# EAGLE design irda-usb-transmitter-V3 (EAGLE 7.2.0)
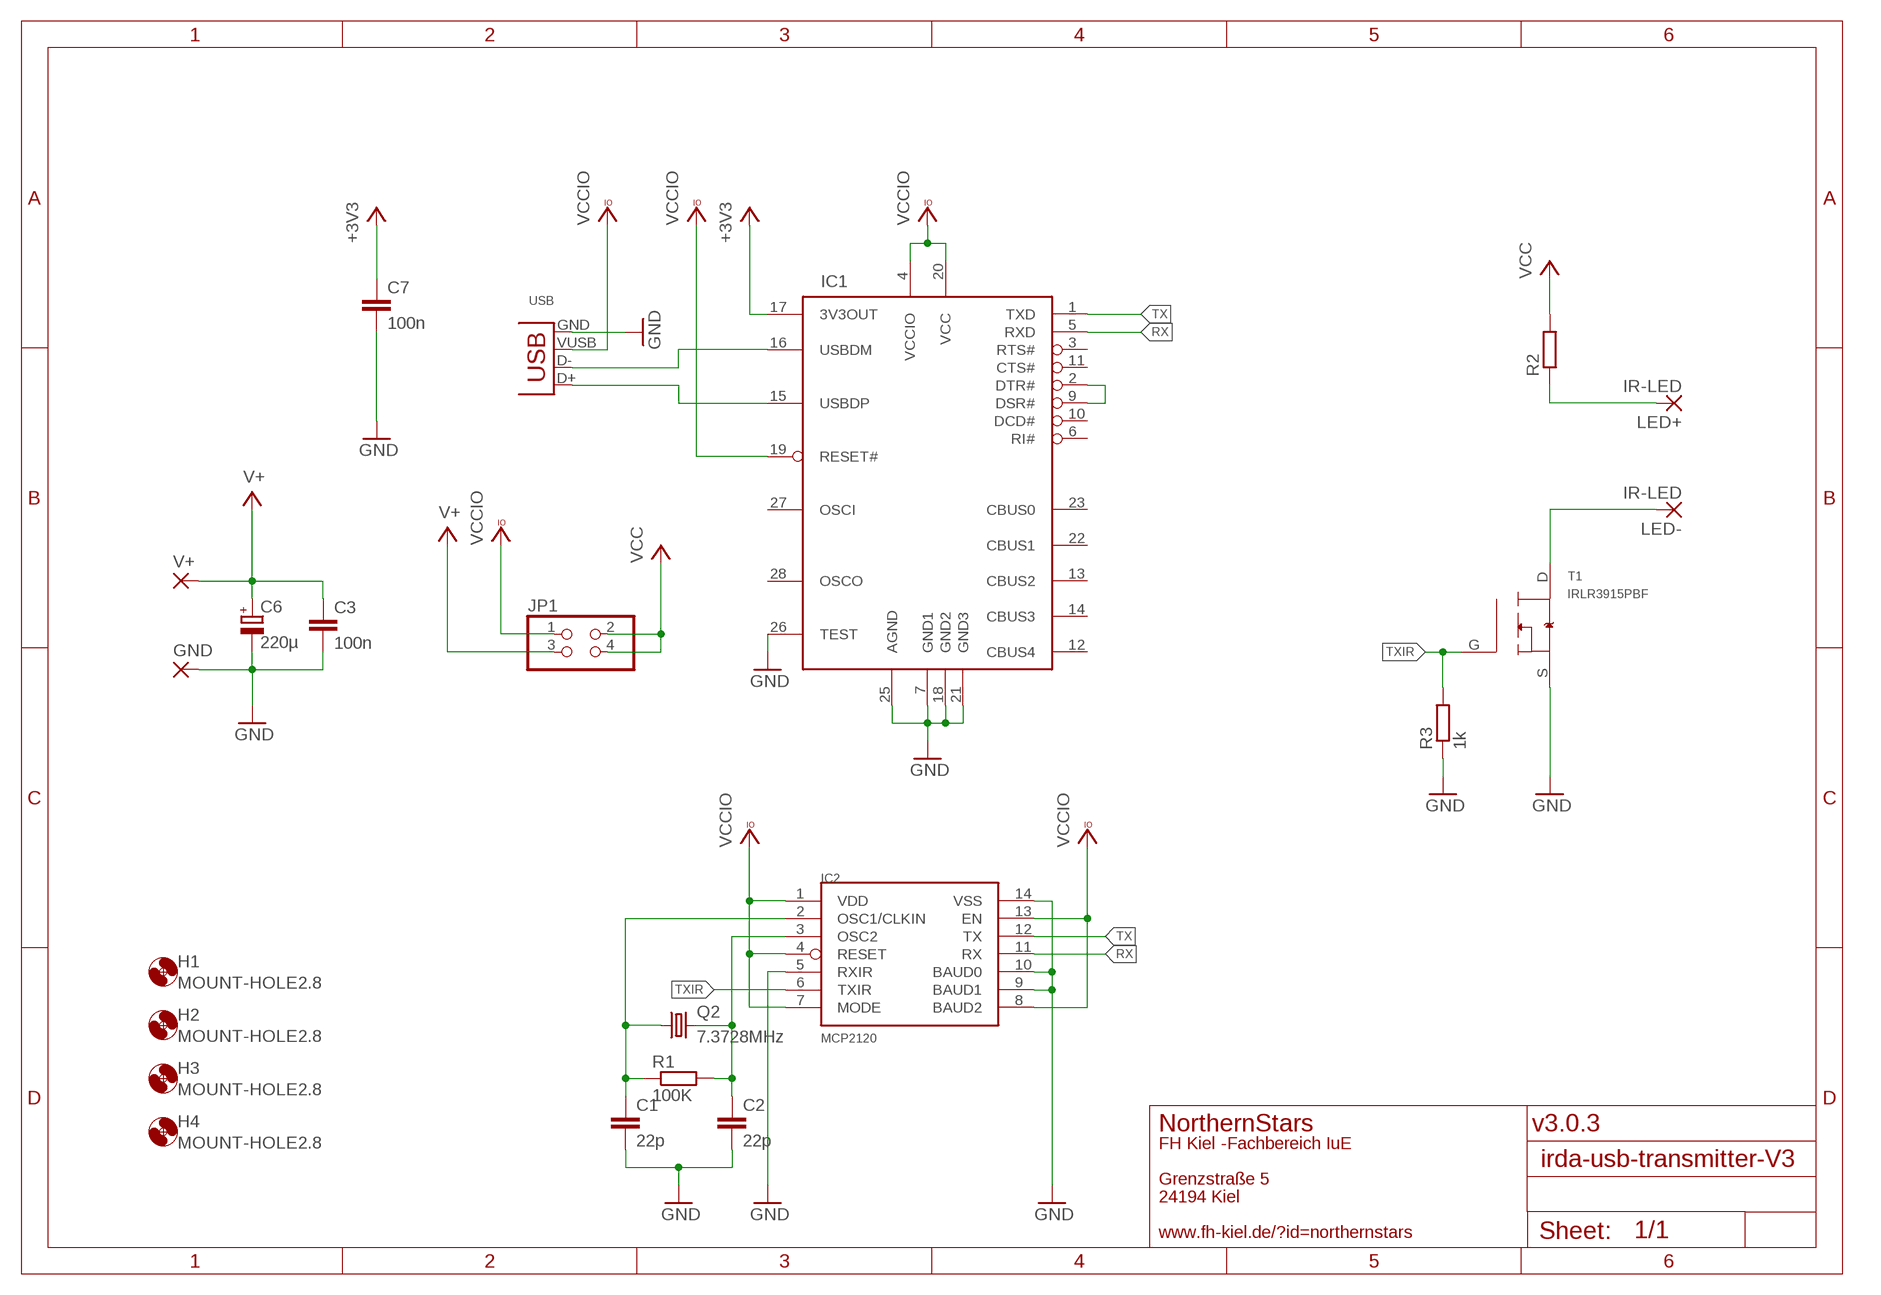
[diagram p0: schematic, sheet 1]

## Parts
C1  22p  C-EUC0805  [C0805]
C2  22p  C-EUC0805  [C0805]
C3  100n  C-EUC1206  [C1206]
C6  220µ  CPOL-EUE3.5-8  [E3,5-8]
C7  100n  C-EUC1206  [C1206]
GND  SMD5  [SMD2,54-5,08]
H1  MOUNT-HOLE2.8  [2,8]
H2  MOUNT-HOLE2.8  [2,8]
H3  MOUNT-HOLE2.8  [2,8]
H4  MOUNT-HOLE2.8  [2,8]
IC1  FT232RL  [SSOP28DB]
IC2  MCP2120  [SO-14]
JP1  PINHD-2X2  [2X02]
LED+  IR-LED  WIREPADSMD5-2,5  [5-2,5]
LED-  IR-LED  WIREPADSMD5-2,5  [5-2,5]
Q2  7.3728MHz  CRYTALHC49UP  [HC49UP]
R1  100K  R-EU_R1206  [R1206]
R2  R-EU_R1206  [R1206]
R3  1k  R-EU_R1206  [R1206]
T1  IRLR3915PBF  [D-PAK]
USB  USB-B-S  [USB-B-SMT]
V+  SMD5  [SMD2,54-5,08]

## Nets
+3V3: C7.1 IC1.17(3V3OUT)
D+: IC1.15(USBDP) USB.D+
D-: IC1.16(USBDM) USB.D-
GND: C1.2 C2.2 C3.2 C6.- C7.2 GND.1(P) IC1.7(GND1) IC1.18(GND2) IC1.21(GND3) IC1.25(AGND) IC1.26(TEST) IC2.5(RXIR) IC2.9(BAUD1) IC2.10(BAUD0) IC2.14(VSS) R3.1 T1.S USB.GND
IRLEDS-: LED-.1(P) T1.D
N$1: LED+.1(P) R2.1
N$3: IC1.2(DTR#) IC1.9(DSR#)
N$9: C1.1 IC2.2(OSC1/CLKIN) Q2.1 R1.1
N$13: C2.1 IC2.3(OSC2) Q2.2 R1.2
RX: IC1.5(RXD) IC2.11(RX)
TX: IC1.1(TXD) IC2.12(TX)
TXIR: IC2.6(TXIR) R3.2 T1.G
V+: C3.1 C6.+ JP1.3 V+.1(P)
VCC: JP1.2 JP1.4 R2.2
VCCIO: IC1.4(VCCIO) IC1.19(RESET#) IC1.20(VCC) IC2.1(VDD) IC2.4(RESET) IC2.7(MODE) IC2.8(BAUD2) IC2.13(EN) JP1.1 USB.VUSB(VBUS)
Unconnected: IC1.3(RTS#) IC1.6(RI#) IC1.10(DCD#) IC1.11(CTS#) IC1.12(CBUS4) IC1.13(CBUS2) IC1.14(CBUS3) IC1.22(CBUS1) IC1.23(CBUS0) IC1.27(OSCI) IC1.28(OSCO)

## Notes on the sheet
- NorthernStars | v3.0.3
- FH Kiel -Fachbereich IuE
- Grenzstraße 5
- 24194 Kiel
- www.fh-kiel.de/?id=northernstars

## Library data of the parts
C1-C3 C7 = rcl:C-EU: CAPACITOR, European symbol
C6 = rcl:CPOL-EU: POLARIZED CAPACITOR, European symbol
GND V+ = wirepad:SMD5: SMD PAD
H1-H4 = holes:MOUNT-HOLE: MOUNTING HOLE with drill center marker
IC1 = ftdichip-3:FT232RL: USB UART 4th Generation USB UART (USB <-> Serial) Controller
IC2 = microchip:MCP2120
JP1 = pinhead:PINHD-2X2: PIN HEADER
LED+ LED- = wirepad:WIREPAD: Wire PAD connect wire on PCB
Q2 = crystal:CRYTAL: CRYSTAL
R1-R3 = rcl:R-EU_: RESISTOR, European symbol
T1 = international:IRLR3915PBF
USB = con-usb-3:USB: USB Connectors

## Board
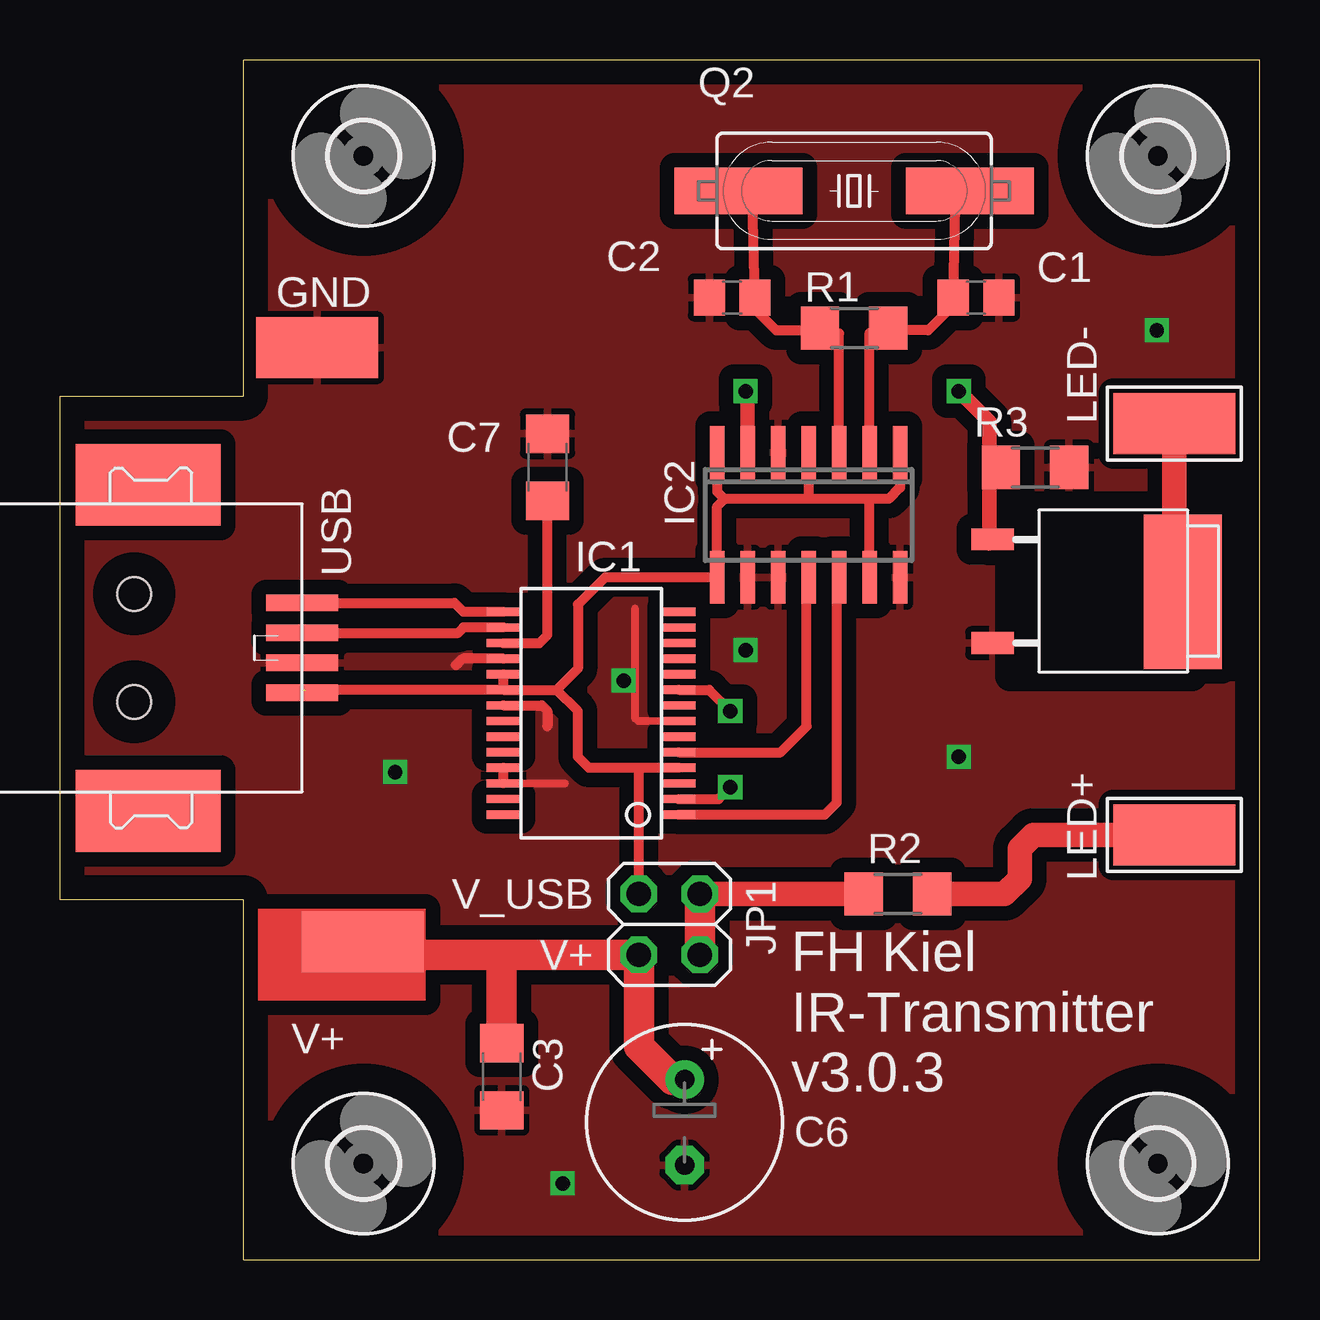
[diagram p1: board, top side]
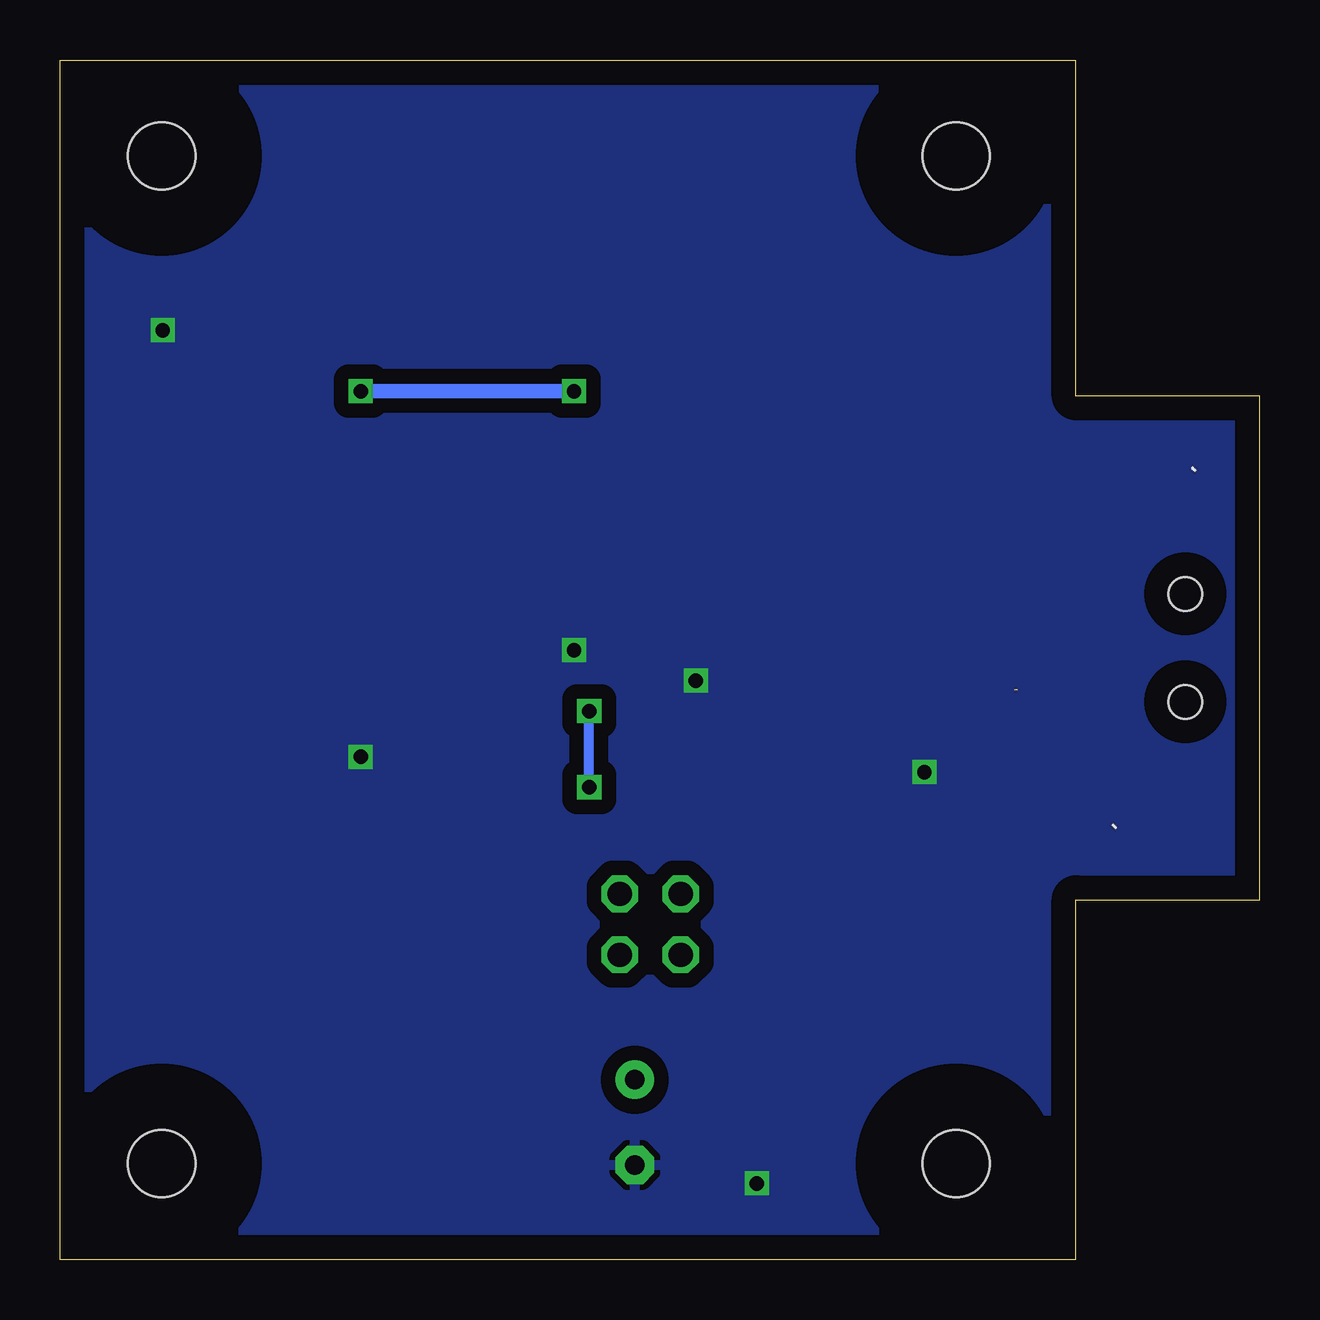
[diagram p2: board, bottom side, seen from below]

Size 50 x 50 mm. Coordinates in mm from the lower left corner, seen from the top.
Outline: 7.65,0 50,0 50,50 7.65,50 7.65,36 0,36 0,15 7.65,15 7.65,0
Copper layers (1*16): Top 0.035mm / dielectric 1.5mm / Bottom 0.035mm
Design rules "default": minimum track width 10mil, minimum drill 24mil, track to track 8mil, track to pad 8mil, pad to pad 8mil, via to via 8mil, smd to smd 8mil, copper to edge 40mil, drill to drill 8mil, minimum pad ring 10mil, minimum via ring 8mil, stop-mask expansion 4mil, vias tented up to drill 0mil, thermal gap 10mil

### Footprints (pad centres in the part's own frame; a part is rotated, then mirrored left to right if it is on the bottom)
C0805 = smd 1.3 x 1.5: 1 -0.95,0; 2 0.95,0
C1206 = smd 1.6 x 1.8: 1 -1.4,0; 2 1.4,0
E3,5-8 = drill 0.813 pad 1.6: + -1.778,0 | drill 0.813 pad 1.6 octagon: - 1.778,0
SMD2,54-5,08 = smd 2.54 x 5.08: 1 0,0
2,8 = hole 2.8: 0,0
SSOP28DB = smd 0.348 x 1.397: 1 -4.225,-3.656; 2 -3.575,-3.656; 3 -2.925,-3.656; 4 -2.275,-3.656; 5 -1.625,-3.656; 6 -0.975,-3.656; 7 -0.325,-3.656; 8 0.325,-3.656; 9 0.975,-3.656; 10 1.625,-3.656; 11 2.275,-3.656; 12 2.925,-3.656; 13 3.575,-3.656; 14 4.225,-3.656; 15 4.225,3.656; 16 3.575,3.656; 17 2.925,3.656; 18 2.275,3.656; 19 1.625,3.656; 20 0.975,3.656; 21 0.325,3.656; 22 -0.325,3.656; 23 -0.975,3.656; 24 -1.625,3.656; 25 -2.275,3.656; 26 -2.925,3.656; 27 -3.575,3.656; 28 -4.225,3.656
SO-14 = smd 0.6 x 2.2: 1 -3.81,-2.6; 2 -2.54,-2.6; 3 -1.27,-2.6; 4 0,-2.6; 5 1.27,-2.6; 6 2.54,-2.6; 7 3.81,-2.6; 8 3.81,2.6; 9 2.54,2.6; 10 1.27,2.6; 11 0,2.6; 12 -1.27,2.6; 13 -2.54,2.6; 14 -3.81,2.6
2X02 = drill 1.016 octagon: 1 -1.27,-1.27; 2 -1.27,1.27; 3 1.27,-1.27; 4 1.27,1.27
5-2,5 = smd 2.54 x 5.08: 1 0,0
HC49UP = smd 5.334 x 1.93: 1 -4.826,0; 2 4.826,0
R1206 = smd 1.6 x 1.803: 1 -1.422,0; 2 1.422,0
D-PAK = smd 6.452 x 3.251: D 0.03,2.89 | smd 0.914 x 1.778: G -2.16,-5.03; S 2.17,-5.03
USB-B-SMT = smd 6.04 x 3.4: 5 0.58,6.8; 6 0.58,-6.8 | smd 3 x 0.7: D+ 7,1.875; D- 7,0.625; GND 7,-0.625; VUSB 7,-1.875 | hole 1.4: 0,2.25; 0,-2.25

### Placement (x,y rotation side)
C1  38.18,40.09 0 top
C2  28.02,40.09 180 top
C3  18.41,7.62 270 top
C6  26.04,5.71 270 top
C7  20.32,33.02 90 top
GND  10.71,38.01 90 top
H1  45.76,46 0 top
H2  12.65,46 0 top
H3  12.65,4 0 top
H4  45.76,4 0 top
IC1  22.14,22.77 90 top
IC2  31.2,31.04 180 top
JP1  25.4,13.97 270 top
LED+  46.45,17.7 90 top
LED-  46.45,34.84 90 top
Q2  33.1,44.54 180 top
R1  33.1,38.83 180 top
R2  34.92,15.24 180 top
R3  40.64,33.02 180 top
T1  43.91,27.86 270 top
USB  3.1,25.5 0 top
V+  12.62,13.24 90 top

### Tracks (layer width: path | path; a pad name or v marks a point on that pad's centre or on a via)
+3V3
  Top 0.406: IC1.17 19.98,25.7 20.32,26.04 C7.1
D+
  Top 0.406: IC1.15 16.82,27 16.44,27.38 USB.D+
D-
  Top 0.406: IC1.16 16.82,26.34 16.6,26.12 USB.D-
GND  (via drill 0.6)
  Top 0.305: IC1.7 24.09,22.45 23.98,22.55 23.98,27.13 | IC1.26 21.05,19.84
  Top 0.406: IC1.18 16.79,25.05 16.51,24.77 | IC1.26 IC1.25 | IC1.21 20.09,23.09 20.32,22.86 20.32,22.23
  other vias: 13.97,20.32 20.95,3.17 23.5,24.13 28.57,25.4 37.47,20.95 45.72,38.73
  pour Top (isolate 0.61): 0,0 0,50.8 52.7,50.8 52.7,0
  pour Bottom (isolate 0.61): 0,0 0,50.8 52.7,50.8 52.7,0
IRLEDS-
  Top 1.016: LED-.1 46.45,28.18
  Top 1.27: 46.45,28.18 T1.D
N$1
  Top 1.016: R2.1 39.37,15.24 40.01,15.88 40.01,17.14 40.57,17.7 LED+.1
N$3  (via drill 0.6)
  Top 0.406: IC1.2 27.45,19.2 v27.94,19.68 | IC1.9 27.05,23.75 v27.94,22.86
  Bottom 0.406: v27.94,19.68 v27.94,22.86
N$9
  Top 0.406: Q2.1 37.33,43.94 C1.1 37.33,39.87 36.2,38.73 34.04,38.73 R1.1 33.74,38.62 IC2.2
N$13
  Top 0.406: Q2.2 28.48,44.54 28.87,44.16 C2.1 28.87,39.71 29.84,38.73 32.16,38.73 R1.2 32.48,38.6 IC2.3
RX
  Top 0.406: IC1.5 30.04,21.14 31.11,22.23 31.11,28.57 31.2,28.48 IC2.11
TX
  Top 0.406: IC1.1 31.88,18.55 32.38,19.05 32.38,28.34 IC2.12
TXIR  (via drill 0.6)
  Top 0.61: IC2.6 28.66,35.65 v28.57,36.2 | v37.47,36.2 38.73,34.92 38.73,33.02 | 38.73,33.02 38.73,29.84 38.88,29.98 T1.G | R3.2 38.73,33.02
  Bottom 0.61: v28.57,36.2 v37.47,36.2
V+
  Top 1.27: 18.41,12.7 JP1.3 24.13,8.89 25.53,7.49 C6.+ | 18.41,12.7 12.62,12.7 V+.1 | C3.1 18.41,12.7
VCC
  Top 1.016: JP1.2 R2.2
  Top 1.27: JP1.4 JP1.2
VCCIO  (1 unrouted)
  Top 0.406: 10.1,23.75 USB.VUSB | IC1.20 10.21,23.75 | IC2.7 27.39,32 27.7,31.7 | IC2.1 35.02,32.17 34.54,31.7 33.63,31.7 | 33.63,31.7 31.19,31.7 | 31.19,31.7 27.7,31.7 | IC2.4 31.2,31.71 31.19,31.7 | 33.63,31.7 33.74,31.58 IC2.13 | 20.7,23.75 21.59,22.86 21.59,20.95 22.05,20.5 24.13,20.5 | 20.7,23.75 21.59,24.63 21.59,27.3 22.72,28.43 IC2.8 27.39,31.39 27.7,31.7 | IC1.4 24.13,20.5 | JP1.1 24.13,20.5 | IC1.20 20.7,23.75 | IC1.20 IC1.19
(copper drawn outside any net)
  shapes: Top area x1

### Text on the board
tNames: V_USB | V+ | FH Kiel / IR-Transmitter / v3.0.3